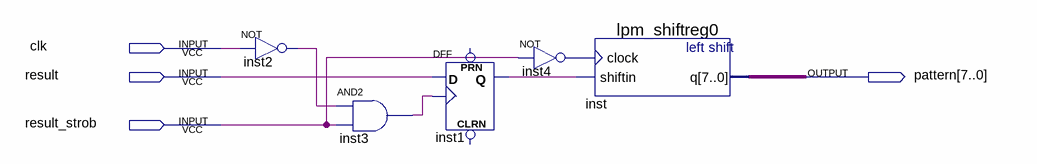
[diagram p0: schematic sheet]
// Quartus schematic TEMPLATE_FORMATION.bdf as structural Verilog: 5 symbols, 4 pins
module TEMPLATE_FORMATION (
  input  clk,
  input  result,
  input  result_strob,
  output [7:0] pattern
);

  wire inst1_q, inst2_out, inst3_out, inst4_out;

  not inst2 (inst2_out, clk);
  and inst3 (inst3_out, inst2_out, result_strob);
  DFF inst1 (.CLK(inst3_out), .D(result), .Q(inst1_q));  // open: CLRN, PRN
  not inst4 (inst4_out, result_strob);
  lpm_shiftreg0 inst (.clock(inst4_out), .shiftin(inst1_q), .q(pattern));
endmodule
